# Altium schematic sheet am.SCHDOC
size B
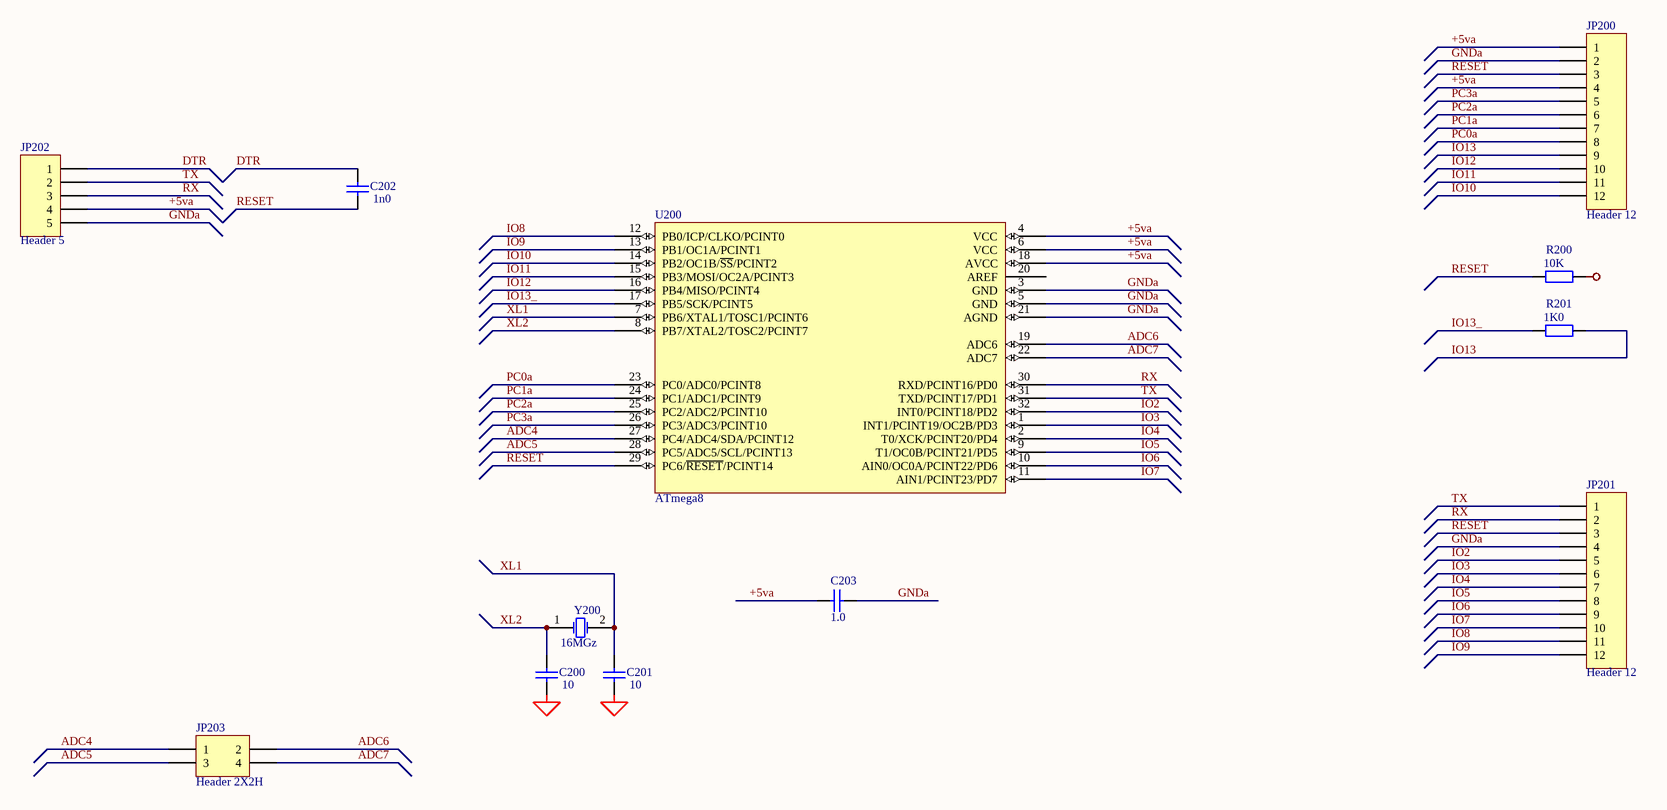
[diagram p0: am.SCHDOC]

## Parts
C200  10  [_1206]
C201  10  [_1206]
C202  1n0  [_1206]
C203  1.0  [_1206]
JP200  Header 12  [HDR1X12]
JP201  Header 12  [HDR1X12]
JP202  Header 5  [HDR1X5]
JP203  Header 2X2H  [HDR2X2]
R200  10K  [_1206]
R201  1K0  [_1206]
U200  ATmega8  [QFP7X7-G32/X.5N]
Y200  16MGz  [qwarz1]

## Nets
+5va: C203.2 JP200.1 JP200.4 JP202.4 R200.1 U200.4(VCC) U200.6(VCC) U200.18(AVCC)
GNDa: C200.1 C201.1 C203.1 JP200.2 JP201.4 JP202.5 U200.3(GND) U200.5(GND) U200.21(AGND)
ADC4: JP203.1 U200.27(PC4/ADC4/SDA/PCINT12)
ADC5: JP203.3 U200.28(PC5/ADC5/SCL/PCINT13)
ADC6: JP203.2 U200.19(ADC6)
ADC7: JP203.4 U200.22(ADC7)
DTR: C202.2 JP202.1
IO2: JP201.5 U200.32(INT0/PCINT18/PD2)
IO3: JP201.6 U200.1(INT1/PCINT19/OC2B/PD3)
IO4: JP201.7 U200.2(T0/XCK/PCINT20/PD4)
IO5: JP201.8 U200.9(T1/OC0B/PCINT21/PD5)
IO6: JP201.9 U200.10(AIN0/OC0A/PCINT22/PD6)
IO7: JP201.10 U200.11(AIN1/PCINT23/PD7)
IO8: JP201.11 U200.12(PB0/ICP/CLKO/PCINT0)
IO9: JP201.12 U200.13(PB1/OC1A/PCINT1)
IO10: JP200.12 U200.14(PB2/OC1B/~{SS}/PCINT2)
IO11: JP200.11 U200.15(PB3/MOSI/OC2A/PCINT3)
IO12: JP200.10 U200.16(PB4/MISO/PCINT4)
IO13: JP200.9 R201.1
IO13_: R201.2 U200.17(PB5/SCK/PCINT5)
PC0a: JP200.8 U200.23(PC0/ADC0/PCINT8)
PC1a: JP200.7 U200.24(PC1/ADC1/PCINT9)
PC2a: JP200.6 U200.25(PC2/ADC2/PCINT10)
PC3a: JP200.5 U200.26(PC3/ADC3/PCINT10)
RESET: C202.1 JP200.3 JP201.3 R200.2 U200.29(PC6/~{RESET}/PCINT14)
RX: JP201.2 JP202.3 U200.30(RXD/PCINT16/PD0)
TX: JP201.1 JP202.2 U200.31(TXD/PCINT17/PD1)
XL1: C201.2 U200.7(PB6/XTAL1/TOSC1/PCINT6) Y200.2(OSC2)
XL2: C200.2 U200.8(PB7/XTAL2/TOSC2/PCINT7) Y200.1(OSC1)

Not connected (* = marked no-connect by the designer): U200 20(AREF)

## Library data of the parts
C200-C203 = Cap Semi: Capacitor; Manufacturer: Generic Components; Class I: Passive; Value: 0,1; Published: 8-Jun-2000; Revision: July-2002: Re-released for DXP Platform.; Publisher: Altium Limited; Class II: Capacitor
JP200 JP201 = Header 12: Header, 12-Pin; Manufacturer: Generic Components; Class I: Connector; Revision: July-2002: Re-released for DXP Platform.; Publisher: Altium Limited
JP202 = Header 5: Header, 5-Pin; Manufacturer: Generic Components; Class I: Connector; Revision: July-2002: Re-released for DXP Platform.; Publisher: Altium Limited
JP203 = Header 2X2H: Header, 2-Pin, Dual row,  Right Angle; Manufacturer: Generic Components; Class I: Connector; Revision: July-2002: Re-released for DXP Platform.; Publisher: Altium Limited
R200 R201 = Res2: Resistor; Manufacturer: Generic Components; Class I: Passive; Value: 1K; Published: 8-Jun-2000; Revision: July-2002: Re-released for DXP Platform.; Publisher: Altium Limited; Class II: Resistor
U200 = ATmega48/TQFP: Right: 180; Bottom: 200
Y200 = XTAL: Crystal Oscillator; Manufacturer: Generic Components; Published: 8-Jun-2000; Revision: July-2002: Re-released for DXP Platform.; Publisher: Altium Limited; Class I: Oscillator; Class II: Crystal Oscillator